# Altium project 27进制.PrjPCB
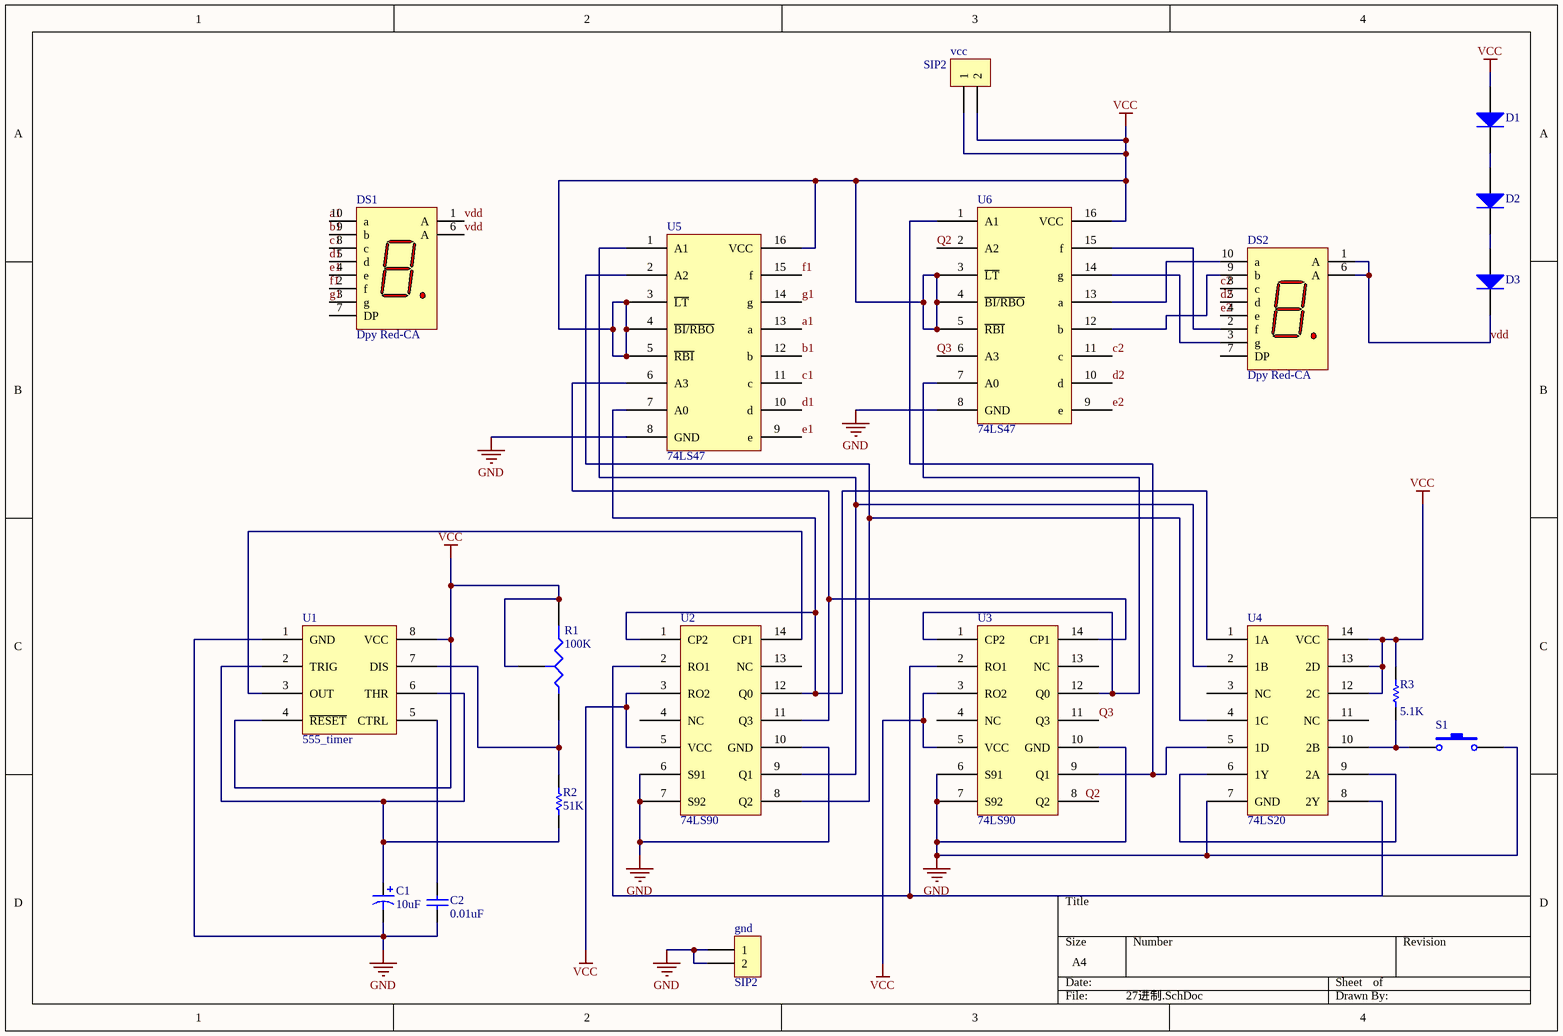
[diagram p0: 27进制.SchDoc]
1 sheet, 19 parts. Net scope: global (net labels, ports and power ports of the same name join across sheets).
Board file: 27进制2.0.PcbDoc

## Sheet 27进制.SchDoc
size A4

### Parts
C1  value 10uF  [RB7.6-15]  (hidden comment: Cap Pol1)
C2  value 0.01uF  [RAD-0.3]  (hidden comment: Cap)
D1  Diode 1N914  [DO-35]  (value not drawn)
D2  Diode 1N914  [DO-35]  (value not drawn)
D3  Diode 1N914  [DO-35]  (value not drawn)
DS1  Dpy Red-CA  [A]
DS2  Dpy Red-CA  [A]
gnd  SIP2  [HDR1X2]
R1  value 100K  [TO-39]  (hidden comment: Res Tap)
R2  value 51K  [AXIAL-0.3]  (hidden comment: Res1)
R3  value 5.1K  [AXIAL-0.3]  (hidden comment: Res1)
S1  SW-PB  [SPST-2]  (value not drawn)
U1  555_timer  [DIP-8]
U2  74LS90  [DIP-14]
U3  74LS90  [DIP-14]
U4  74LS20  [DIP-14]
U5  74LS47  [DIP-16]
U6  74LS47  [DIP-16]
vcc  SIP2  [HDR1X2]

### Nets
GND: C1.2 C2.1 gnd.1 gnd.2 S1.2 U1.1(GND) U2.6(S91) U2.7(S92) U2.10(GND) U3.6(S91) U3.7(S92) U3.10(GND) U4.7(GND) U5.8(GND) U6.8(GND)
VCC: D1.1(A) R1.2(B) R1.3(TAP) R3.2 U1.4(~{RESET}) U1.8(VCC) U2.3(RO2) U2.5(VCC) U3.3(RO2) U3.5(VCC) U4.12(2C) U4.13(2D) U4.14(VCC) U5.3(~{LT}) U5.4(~{BI/RBO}) U5.5(~{RBI}) U5.16(VCC) U6.3(~{LT}) U6.4(~{BI/RBO}) U6.5(~{RBI}) U6.16(VCC) vcc.1 vcc.2
a1: DS1.10(a) U5.13(a)
b1: DS1.9(b) U5.12(b)
c1: DS1.8(c) U5.11(c)
c2: DS2.8(c) U6.11(c)
d1: DS1.5(d) U5.10(d)
d2: DS2.5(d) U6.10(d)
e1: DS1.4(e) U5.9(e)
e2: DS2.4(e) U6.9(e)
f1: DS1.2(f) U5.15(f)
g1: DS1.3(g) U5.14(g)
Q2: U6.2(A2)
Q3: U3.11(Q3) U6.6(A3)
vdd: D3.2(K) DS1.1(A) DS1.6(A) DS2.1(A) DS2.6(A)
NetC1_1: C1.1 R2.1 U1.2(TRIG) U1.6(THR)
NetC2_2: C2.2 U1.5(CTRL)
NetD1_2: D1.2(K) D2.1(A)
NetD2_2: D2.2(K) D3.1(A)
NetDS2_2: DS2.2(f) U6.15(f)
NetDS2_3: DS2.3(g) U6.14(g)
NetDS2_9: DS2.9(b) U6.12(b)
NetDS2_10: DS2.10(a) U6.13(a)
NetR1_1: R1.1(A) R2.2 U1.7(DIS)
NetR3_1: R3.1 S1.1 U4.10(2B)
NetU1_3: U1.3(OUT) U2.14(CP1)
NetU2_1: U2.1(CP2) U2.12(Q0) U4.1(1A) U5.7(A0)
NetU2_2: U2.2(RO1) U3.2(RO1) U4.8(2Y)
NetU2_8: U2.8(Q2) U4.4(1C) U5.2(A2)
NetU2_9: U2.9(Q1) U4.2(1B) U5.1(A1)
NetU2_11: U2.11(Q3) U3.14(CP1) U5.6(A3)
NetU3_1: U3.1(CP2) U3.12(Q0) U6.7(A0)
NetU3_9: U3.9(Q1) U4.5(1D) U6.1(A1)
NetU4_6: U4.6(1Y) U4.9(2A)

Not connected (* = marked no-connect by the designer): DS1 7(DP); DS2 7(DP); U2 4(NC) 13(NC); U3 4(NC) 8(Q2) 13(NC); U4 3(NC) 11(NC)

### Notes on the sheet
- Labels drawn without touching a wire or pin: Q2

### Library data of the parts
C1 = Cap Pol1: Polarized Capacitor (Radial); Published: 8-Jun-2000; LatestRevisionDate: 17-Jul-2002; LatestRevisionNote: Re-released for DXP Platform.; PackageReference: RB7.6-15; Publisher: Altium Limited; PackageDescription: Polarized Capacitor (Radial); 2 Leads
C2 = Cap: Capacitor; Published: 8-Jun-2000; LatestRevisionDate: 17-Jul-2002; LatestRevisionNote: Re-released for DXP Platform.; PackageReference: RAD-0.3; Publisher: Altium Limited; PackageDescription: Radial Cap, Thru-Hole; 2 Leads; 0.3 in Pin Spacing
D1-D3 = Diode 1N914: High Conductance Fast Diode; Published: 8-Jun-2000; LatestRevisionDate: 17-Jul-2002; LatestRevisionNote: Re-released for DXP Platform.; DatasheetVersion: 1997; PackageReference: DO-35; Publisher: Altium Limited; PackageDescription: Diode, Axial; Body 3.8 x 1.9 mm (LxDia. max), Lead Dia. 0.53 mm (max); Code_JEDEC: DO-204-AH; ComponentLink1Description: Manufacturer Link; ComponentLink1URL: http://www.fairchildsemi.com/; ComponentLink2Description: Datasheet; ComponentLink2URL: http://www.fairchildsemi.com/ds/1N%2F1N4448.pdf
DS1 DS2 = Dpy Red-CA: 7.62 mm Black Surface HER 7-Segment Display: CA, RH DP; MinimumIntensity: 360 ucd; Note: IF = 5 mA; Colour: High Efficiency Red (HER); Note: Pins 1 and 6 are redundant Anodes.; Published: 8-Jun-2000; LatestRevisionDate: 17-Dec-2003; LatestRevisionNote: Schematic revised, PCB Footprint replaced.; DatasheetVersion: 19-Feb-2002; PackageVersion: 11-Feb-2002; PackageReference: A; Publisher: Altium Limited; PackageDescription: LED, 7-Segment Display, 7.62 mm, RHD; 10 Leads; Row Space 5.08 mm; Pitch 2.54 mm; ComponentLink1Description: Manufacturer Link; ComponentLink1URL: http://www.agilent.com/
gnd vcc = SIP2: jointbar
R1 = Res Tap: Tapped Resistor; Sim Note: Enter the Resistance value and the set point into parameter fields.; Set Position: 0.5; Published: 24-Mar-1999; LatestRevisionDate: 17-Jul-2002; LatestRevisionNote: Re-released for DXP Platform.; PackageReference: VR3; Publisher: Altium Limited; PackageDescription: Variable Resistor, Thru-Hole; 3 Leads
R2 R3 = Res1: Resistor; Published: 8-Jun-2000; LatestRevisionDate: 17-Jul-2002; LatestRevisionNote: Re-released for DXP Platform.; PackageReference: AXIAL-0.3; Publisher: Altium Limited; PackageDescription: Axial Device, Thru-Hole; 2 Leads; 0.3 in Pin Spacing
S1 = SW-PB: Switch; Published: 24-Mar-1999; LatestRevisionDate: 17-Jul-2002; LatestRevisionNote: Re-released for DXP Platform.; PackageReference: SPST-2; Publisher: Altium Limited; PackageDescription: Switch; 2 Leads